# EAGLE schematic rc_controller_reciever_motor_prototype (EAGLE 9.6.2)
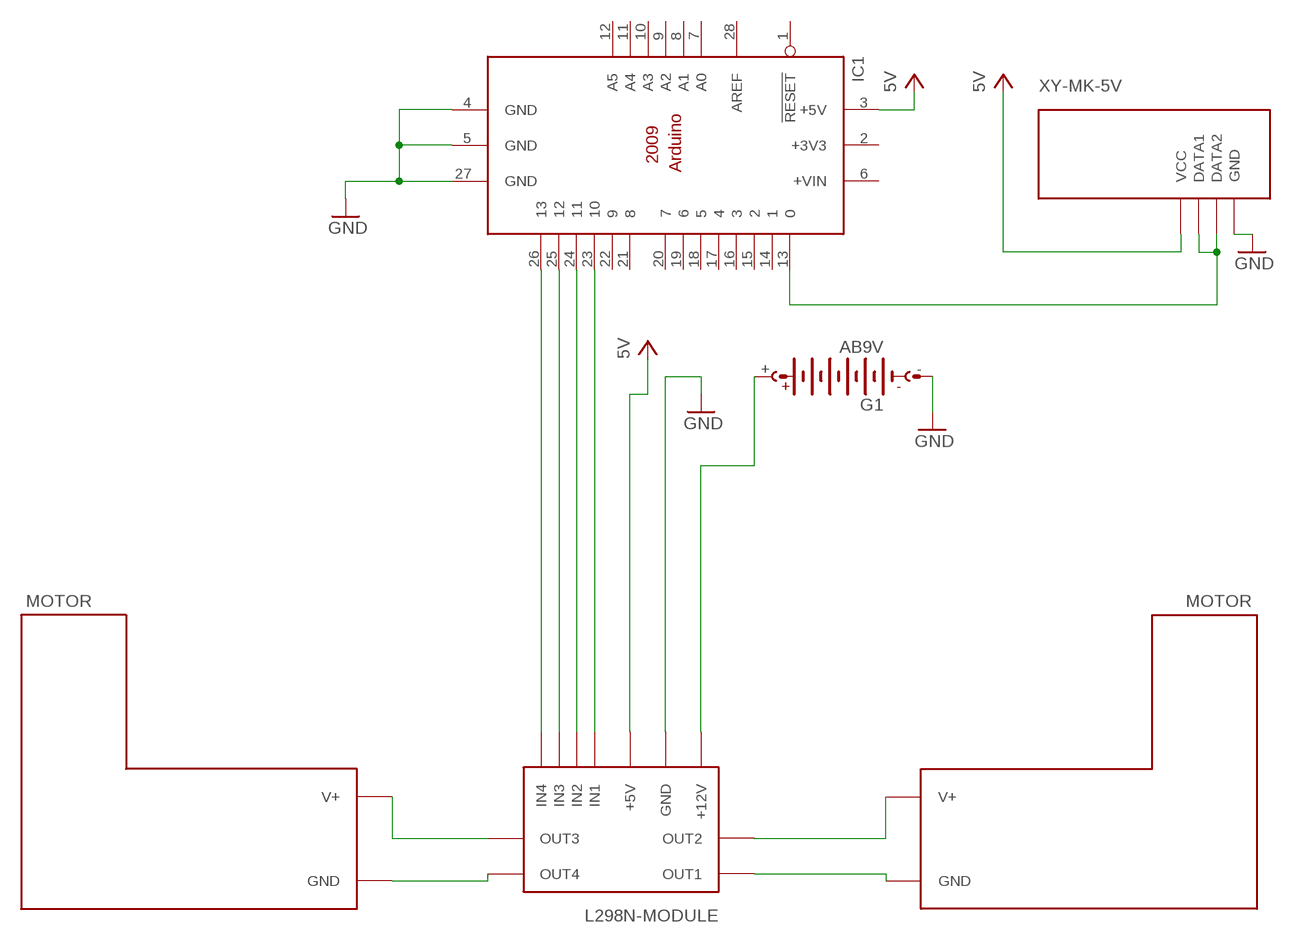
[diagram p0: schematic, sheet 1]

## Parts
G1  AB9V  [AB9V]
IC1  ARDUINO2009_10  [ARDUINO2009]
U$1  XY-MK-5V  (no package)
U$2  L298N-MODULE  (no package)
U$3  MOTOR  (no package)
U$4  MOTOR  (no package)

## Nets
5V: U$1.VCC
GND: G1.- IC1.4(GND) IC1.5(GND) IC1.27(GND) U$1.GND U$2.GND
N$1: IC1.26 U$2.IN4
N$2: IC1.25 U$2.IN3
N$3: IC1.24 U$2.IN2
N$4: IC1.23 U$2.IN1
N$5: G1.+ U$2.+12V
N$6: U$2.OUT3 U$3.V+
N$7: U$2.OUT4 U$3.GND
N$8: U$2.OUT1 U$4.GND
N$9: U$2.OUT2 U$4.V+
N$12: IC1.13 U$1.DATA1 U$1.DATA2
VCC: IC1.3(+5V) U$2.+5V ; supply symbol labelled 5V
Unconnected: IC1.1(!RESET) IC1.6(+VIN) IC1.7(A0) IC1.8(A1) IC1.9(A2) IC1.10(A3) IC1.11(A4) IC1.12(A5) IC1.14 IC1.15 IC1.16 IC1.17 IC1.18 IC1.19 IC1.20 IC1.21 IC1.22 IC1.28(AREF)

## Power pins joined to a net without a drawn wire
+3V3: IC1.2(+3V3)

## Library data of the parts
G1 = battery:AB9V: 9-V BATTERY CLIP
IC1 = arduino:ARDUINO2009_1: The Arduino Duemilanove ("2009") is a microcontroller board based on the ATmega168 or ATmega328. - 14 digital input/output pins (of which 6 can be used as PWM outputs) - 6 analog inputs, a 16 MHz crystal oscillator - USB connection - power jack - ISP header - reset button It contains everything needed to support the microcontroller; simply connect it to a computer with a USB cable or power it with a AC-to-DC adapter or battery to get started http://arduino.cc/en/Main/ArduinoBoardDuemilanove
U$1 = mylibrary:XY-MK-5V
U$2 = mylibrary:L298N-MODULE
U$3 U$4 = mylibrary:MOTOR